# Altium schematic sheet ADJ_REG.SchDoc
size A4; SheetNumber: 3; SheetTotal: 3
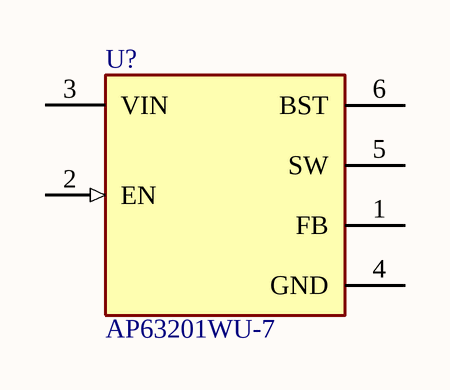
[diagram p0: ADJ_REG.SchDoc]

## Parts
U?  AP63201WU-7  [FP-TSOT26-MFG]

## Nets

Not connected (* = marked no-connect by the designer): U? 1(FB) 2(EN) 3(VIN) 4(GND) 5(SW) 6(BST)

## Library data of the parts
U? = CMP-12757-000019-1: IC REG BUCK ADJUSTABLE 2A TSOT26